# EasyEDA Pro project Controller_PCB.eprj

# Schematic Schematic1
Create Date: 2024-01-11; Page Name: P1; Project Name: 机甲杯手柄pcb; Schematic Name: Schematic1; Update Date: 2024-02-03; Company: 嘉立创EDA; Page Size: A4; Version: V1.0
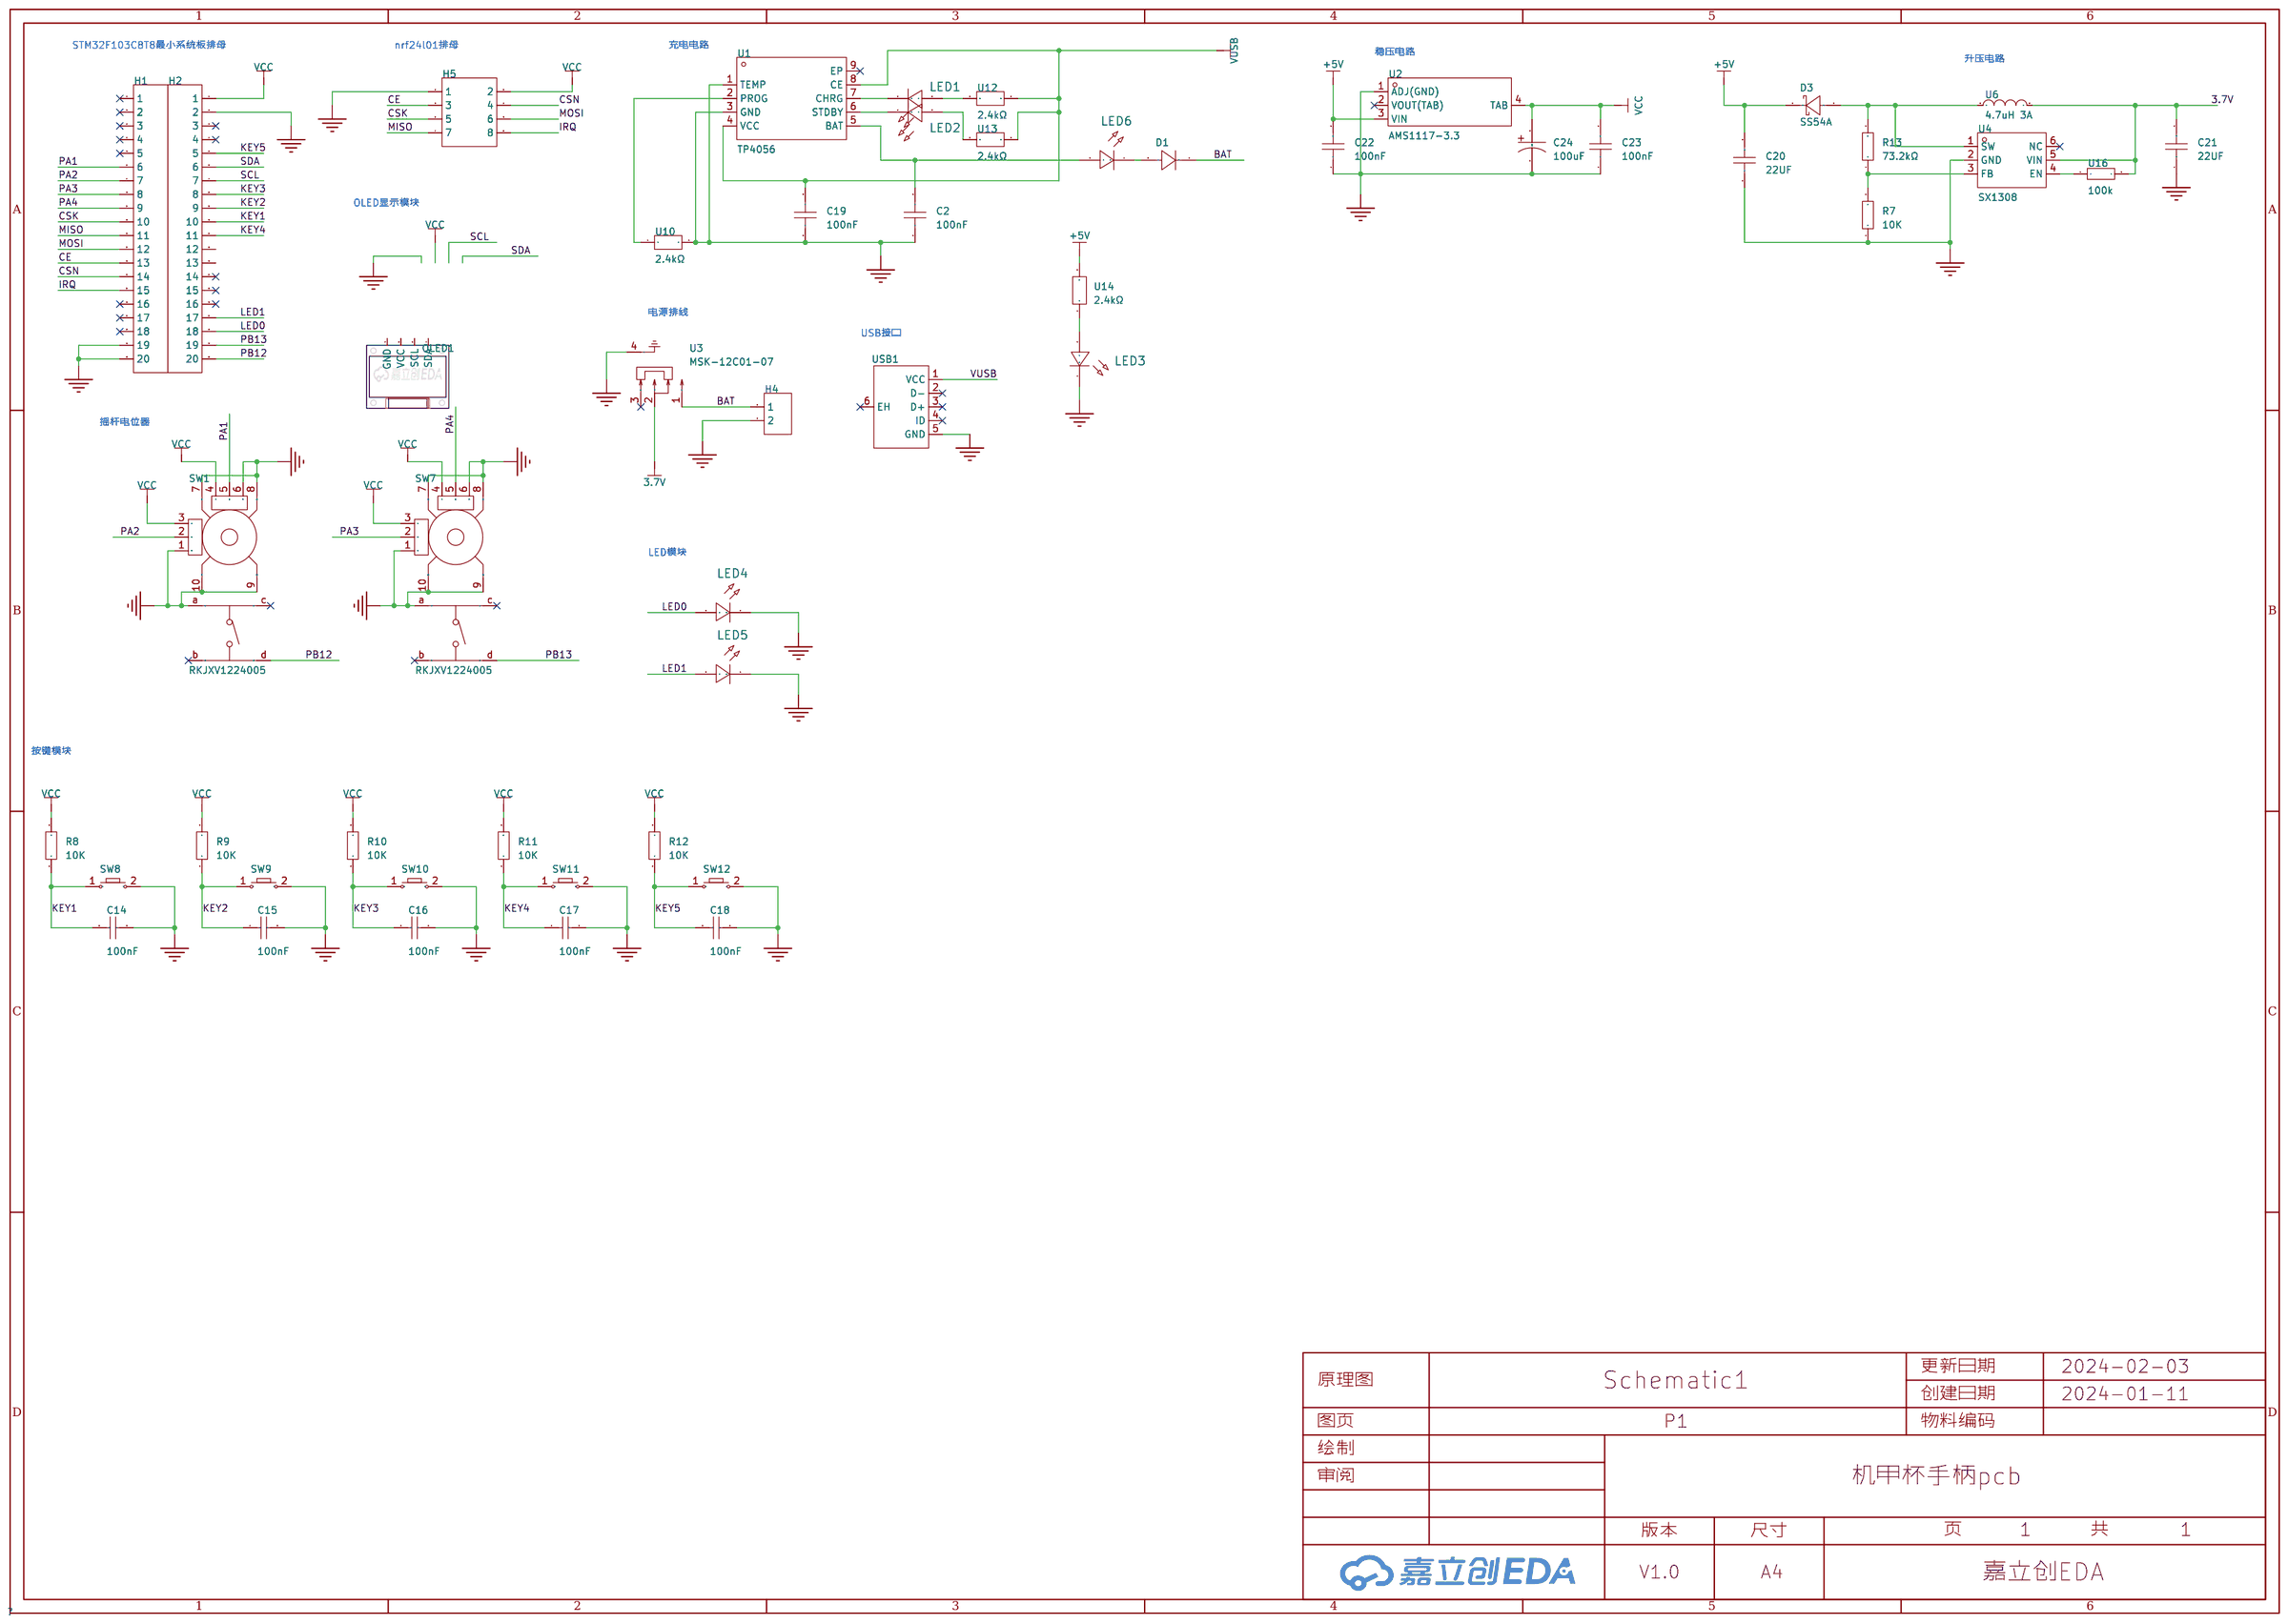
[diagram p0: schematic sheet]

## Parts
C2  100nF  [C0805]
C14  100nF  [C0805]
C15  100nF  [C0805]
C16  100nF  [C0805]
C17  100nF  [C0805]
C18  100nF  [C0805]
C19  100nF  [C0805]
C20  22UF  [C1206]
C21  22UF  [C1206]
C22  100nF  [C0603]
C23  100nF  [C0603]
C24  100uF  [CASE-D_7343]
D1  -  [DO_1N4007]
D3  SS54A  [SMA_L4.2-W2.6-LS5.1-RD]
H1  -  [HDR-TH_20P-P2.54-V-F]
H2  -  [HDR-TH_20P-P2.54-V-F]
H4  -  [HDR-TH_2P-P2.54-V-F]
H5  -  [HDR-TH_8P-P2.54-V-F-R2-C4-S2.54-1]
LED1  -  [LED_0603]
LED2  -  [LED_0603]
LED3  -  [LED_0603]
LED4  -  [LED_0603]
LED5  -  [LED_0603]
LED6  -  [LED_0603]
OLED1  -  [0.96OLED_4P]
R7  10K  [R0603]
R8  10K  [R0603]
R9  10K  [R0603]
R10  10K  [R0603]
R11  10K  [R0603]
R12  10K  [R0603]
R13  73.2kΩ  [R0603]
SW1  RKJXV1224005  [SW-TH_RKJXV1224005]
SW7  RKJXV1224005  [SW-TH_RKJXV1224005]
SW8  -  [Key_SMD_3x4x2]
SW9  -  [Key_SMD_3x4x2]
SW10  -  [Key_SMD_3x4x2]
SW11  -  [Key_SMD_3x4x2]
SW12  -  [Key_SMD_3x4x2]
U1  TP4056  [ESOP-8_L4.9-W3.9-P1.27-LS6.0-BL-EP]
U2  AMS1117-3.3  [SOT-223-4_L6.5-W3.5-P2.30-LS7.0-BR]
U3  MSK-12C01-07  [SW-SMD_MSK12CO2-BDM]
U4  SX1308  [SOT-23-6_L2.9-W1.6-P0.95-LS2.8-BL]
U6  4.7uH 3A  [IND-SMD_L7.3-W7.3_GSDRH74P]
U10  2.4kΩ  [R0603]
U12  2.4kΩ  [R0603]
U13  2.4kΩ  [R0603]
U14  2.4kΩ  [R0603]
U16  100k  [R0603]
USB1  -  [USB_Micro]

## Library data of the parts
C2 C14-C19 = CL21B104KCFNNNE: 容值:100nF;精度:±10%;额定电压:100V;材质(温度系数):X7R;; LCSC Part Name: 100nF ±10% 100V; Supplier Part: C28233; Manufacturer: SAMSUNG(三星); Supplier Footprint: 0805; JLCPCB Part Class: 基础库; Datasheet: https://atta.szlcsc.com/upload/public/pdf/source/20160218/1457707763339.pdf; Supplier: LCSC; Tolerance: ±10%; Voltage Rated: 100V; Temperature Coefficient: X7R
C20 C21 = 22UF: Supplier Part: C9900008064; Supplier Footprint: 1206; JLCPCB Part Class: 扩展库; Supplier: LCSC
C22 C23 = CC0603KRX7R9BB104: 容值:100nF;精度:±10%;额定电压:50V;材质(温度系数):X7R;; LCSC Part Name: 100nF ±10% 50V; Supplier Part: C14663; Manufacturer: YAGEO(国巨); Supplier Footprint: 0603; JLCPCB Part Class: 基础库; Datasheet: https://atta.szlcsc.com/upload/public/pdf/source/20180910/C282072_33301C7F631E79921B82A8DAC6BCC5B3.pdf; Supplier: LCSC; Tolerance: ±10%; Voltage Rated: 50V; Temperature Coefficient: X7R
C24 = NOJD107M006RWJ: 容值:100uF;精度:±20%;额定电压:6.3V;等效串联电阻:400mΩ@100kHz;; LCSC Part Name: 100uF ±20% 6.3V; Supplier Part: C308911; Manufacturer: Kyocera AVX; Supplier Footprint: CASE-D-7343; JLCPCB Part Class: 扩展库; Datasheet: https://atta.szlcsc.com/upload/public/pdf/source/20181129/C313062_608915A7FC61F417DBFBE9E11EC9EEDE.pdf; Supplier: LCSC; Tolerance: ±20%; Rated Voltage: 6.3V; Equivalent Series Resistance(ESR): 400mΩ@100kHz; Operating Temperature: -55℃~+105℃
D1 = D_1N4007A: Supplier Footprint: DO-41
D3 = SS54A: 二极管配置:独立式;正向压降(Vf):550mV@5A;直流反向耐压(Vr):40V;平均整流电流(Io):5A;; LCSC Part Name: 电压:40V 电流:5A; Supplier Part: C842792; Manufacturer: FUXINSEMI(富芯森美); Supplier Footprint: SMA(DO-214AC); JLCPCB Part Class: 扩展库; Datasheet: https://atta.szlcsc.com/upload/public/pdf/source/20200930/C842792_5106C80DF0E850BA03D1CC0EA757AD9D.pdf; Supplier: LCSC; Diode Configuration: 独立式; Forward Voltage (Vf@If): 550mV@5A; Reverse Voltage (Vr): 40V; Average Rectified Current (Io): 5A; Reverse Leakage Current (Ir): 500nA
H1 H2 = HDR-F_2.54_1x20P: Supplier Part: C50984; Supplier Footprint: 插件
H4 = HDR-F_2.54_1x2P: Supplier Part: C49661; Supplier Footprint: 插件
H5 = HDR-F_2.54_2x4: Supplier Part: C92271; Supplier Footprint: 插件; JLCPCB Part Class: 扩展库
LED1-LED6 = LED_0603-R: Supplier Footprint: 0603
OLED1 = 0.96OLED模块_4P: Supplier Footprint: 插件
R7-R12 = Res_0603: Supplier Footprint: 0603
R13 = AC0603FR-0773K2L: 电阻类型:厚膜电阻;阻值:73.2kΩ;精度:±1%;功率:100mW;最大工作电压:75V;温度系数:±100ppm/℃;; LCSC Part Name: 厚膜电阻 73.2kΩ ±1% 100mW; Supplier Part: C228044; Manufacturer: YAGEO(国巨); Supplier Footprint: 0603; JLCPCB Part Class: 扩展库; Datasheet: https://atta.szlcsc.com/upload/public/pdf/source/20181031/C228044_B46D30D08D205BDF2C7D9FF4D943A2A8.pdf; Supplier: LCSC; Type: 厚膜电阻; Tolerance: ±1%; Power(Watts): 100mW; Overload Voltage (Max): 75V; Temperature Coefficient: ±100ppm/℃; Operating Temperature Range: -55℃~+155℃
SW1 SW7 = RKJXV1224005: 操纵杆复位 中央按动开关 适用于航模玩具遥控器电位器、3D摇杆PS4手柄游戏机、无人机摇杆电位器、工业控制器; Supplier Part: C146170; Manufacturer: ALPSALPINE(阿尔卑斯阿尔派); Supplier Footprint: 插件,13x13mm; JLCPCB Part Class: 扩展库; Datasheet: https://atta.szlcsc.com/upload/public/pdf/source/20180125/C146170_15168615510911301620.pdf; Supplier: LCSC
SW8-SW12 = Key_SMD_3x4x2: Supplier Footprint: SMD
U1 = TP4056: Supplier Part: C9900002169; Supplier Footprint: ESOP-8; JLCPCB Part Class: 扩展库; Supplier: LCSC
U2 = AMS1117-3.3_C347222: 输出类型:固定;最大输入电压:18V;输出电压:3.3V;输出电流:1A;电源纹波抑制比(PSRR):60dB@(120Hz);输出极性:正;; LCSC Part Name: 输入18V 输出3.3V 1A; Supplier Part: C347222; Manufacturer: UMW(友台半导体); Supplier Footprint: SOT-223; JLCPCB Part Class: 扩展库; Datasheet: https://atta.szlcsc.com/upload/public/pdf/source/20231109/155D79A26D9DB04352555A58D5969DC8.pdf; Supplier: LCSC; Output Type: 固定; Maximum Input Voltage: 18V; Output Voltage: 3.3V; Output Current: 1A; Power Supply Rejection Ratio (PSRR): 60dB@(120Hz); Dropout Voltage: 1.3V@(1A); Output Polarity: 正; Number of Outputs: 1
U3 = MSK-12C01-07: Supplier Part: C9900005167; Supplier Footprint: SMD; JLCPCB Part Class: 扩展库; Supplier: LCSC
U4 = SX1308: 功能类型:升压型;同步整流:否;输出通道数:1;拓扑结构:升压式;输入电压:2V~24V;输出电压:28V;输出电流(最大值):-;开关频率:1.2MHz;; LCSC Part Name: 升压型 Vin=2V~24V Vout=28V; Supplier Part: C78162; Manufacturer: SX(硕芯科技); Supplier Footprint: SOT-23-6; JLCPCB Part Class: 扩展库; Datasheet: https://atta.szlcsc.com/upload/public/pdf/source/20160920/1474356679185.pdf; Supplier: LCSC; Function: 升压型; Synchronous Rectification: 否; Number of Outputs: 1; Topology: 升压式; Input Voltage: 2V~24V; Output Voltage: 28V; Switching Frequency: 1.2MHz
U6 = 4.7uH 3A: Supplier Part: C9900003590; Supplier Footprint: 4.7uH2A; JLCPCB Part Class: 扩展库; Datasheet: https://atta.szlcsc.comnull; Supplier: LCSC
U10 U12-U14 = PTFR0603B2K40N9: 电阻类型:薄膜电阻;阻值:2.4kΩ;精度:±0.1%;功率:100mW;最大工作电压:100V;温度系数:±10ppm/℃;; LCSC Part Name: 薄膜电阻 2.4kΩ ±0.1% 100mW; Supplier Part: C2692752; Manufacturer: RESI(开步睿思）; Supplier Footprint: 0603; JLCPCB Part Class: 扩展库; Datasheet: https://atta.szlcsc.com/upload/public/pdf/source/20231020/37F75D505DFC5CA75CC16B0F0ECD8764.pdf; Supplier: LCSC; Type: 薄膜电阻; Tolerance: ±0.1%; Power(Watts): 100mW; Overload Voltage (Max): 100V; Temperature Coefficient: ±10ppm/℃; Operating Temperature Range: -55℃~+125℃
U16 = 100k: Supplier Part: C9900012835; JLCPCB Part Class: 扩展库; Supplier: LCSC
USB1 = USB_Micro-B: Supplier Footprint: SMD

## Nets
3.7V: C21.2 U3.2 U4.5(VIN) U6.2 U16.2
+5V: C20.2 C22.2 D3.1(C) U2.3(VIN) U14.2
GND: C2.1 C14.2 C15.2 C16.2 C17.2 C18.2 C19.1 C20.1 C21.1 C22.1 C23.1 C24.2 H1.19 H1.20 H2.2 H4.2 H5.1 LED3.1(C) LED4.1(C) LED5.1(C) R7.1 SW1.1(B) SW1.6(B) SW1.7(GND) SW1.8(GND) SW1.9(GND) SW1.10(GND) SW1.a SW7.1(B) SW7.6(B) SW7.7(GND) SW7.8(GND) SW7.9(GND) SW7.10(GND) SW7.a SW8.2 SW9.2 SW10.2 SW11.2 SW12.2 U1.1(TEMP) U1.3(GND) U2.1(ADJ(GND)) U3.4 U4.2(GND) U10.2 USB1.5(GND)
VCC: C23.2 C24.1 H2.1 H5.2 R8.2 R9.2 R10.2 R11.2 R12.2 SW1.3(A) SW1.4(A) SW7.3(A) SW7.4(A) U2.4(TAB)
BAT: D1.1(K) H4.1 U3.1
CE: H1.13 H5.3
CSK: H1.10 H5.5
CSN: H1.14 H5.4
IRQ: H1.15 H5.8
KEY1: C14.1 H2.10 R8.1 SW8.1
KEY2: C15.1 H2.9 R9.1 SW9.1
KEY3: C16.1 H2.8 R10.1 SW10.1
KEY4: C17.1 H2.11 R11.1 SW11.1
KEY5: C18.1 H2.5 R12.1 SW12.1
LED0: H2.18 LED4.2(A)
LED1: H2.17 LED5.2(A)
MISO: H1.11 H5.7
MOSI: H1.12 H5.6
PA1: H1.6 SW1.5(DTA)
PA2: H1.7 SW1.2(DTA)
PA3: H1.8 SW7.2(DTA)
PA4: H1.9 SW7.5(DTA)
PB12: H2.20 SW1.d
PB13: H2.19 SW7.d
SCL: H2.7
SDA: H2.6
VUSB: C19.2 U1.4(VCC) U1.8(CE) U12.2 U13.2 USB1.1(VCC)
$1N9186: U1.2(PROG) U10.1
$1N9797: LED1.1(C) U1.7(CHRG)
$1N9800: LED2.1(C) U1.6(STDBY)
$1N9803: LED1.2(A) U12.1
$1N9806: LED2.2(A) U13.1
$1N10862: LED3.2(A) U14.1
$1N14342: U4.4(EN) U16.1
$1N14522: R7.2 R13.1 U4.3(FB)
$1N23594: C2.2 LED6.2(A) U1.5(BAT)
$1N23595: D1.2(A) LED6.1(C)
$1N23688: D3.2(A) R13.2 U4.1(SW) U6.1

Not connected (* = marked no-connect by the designer): H1 1* 2* 3* 4* 5* 16* 17* 18*; H2 3* 4* 12 13 14* 15* 16*; OLED1 1(GND) 2(VCC) 3(SCL) 4(SDA); SW1 b* c*; SW7 b* c*; U1 9(EP)*; U2 2(VOUT(TAB))*; U3 3*; U4 6(NC)*; USB1 2(D-)* 3(D+)* 4(ID)* 6(EH)*

## Notes on the sheet
- STM32F103C8T8最小系统板排母
- nrf24l01排母
- 充电电路
- 稳压电路
- 升压电路
- OLED显示模块
- 电源排线
- USB接口
- 摇杆电位器
- LED模块
- 按键模块

# Board PCB1
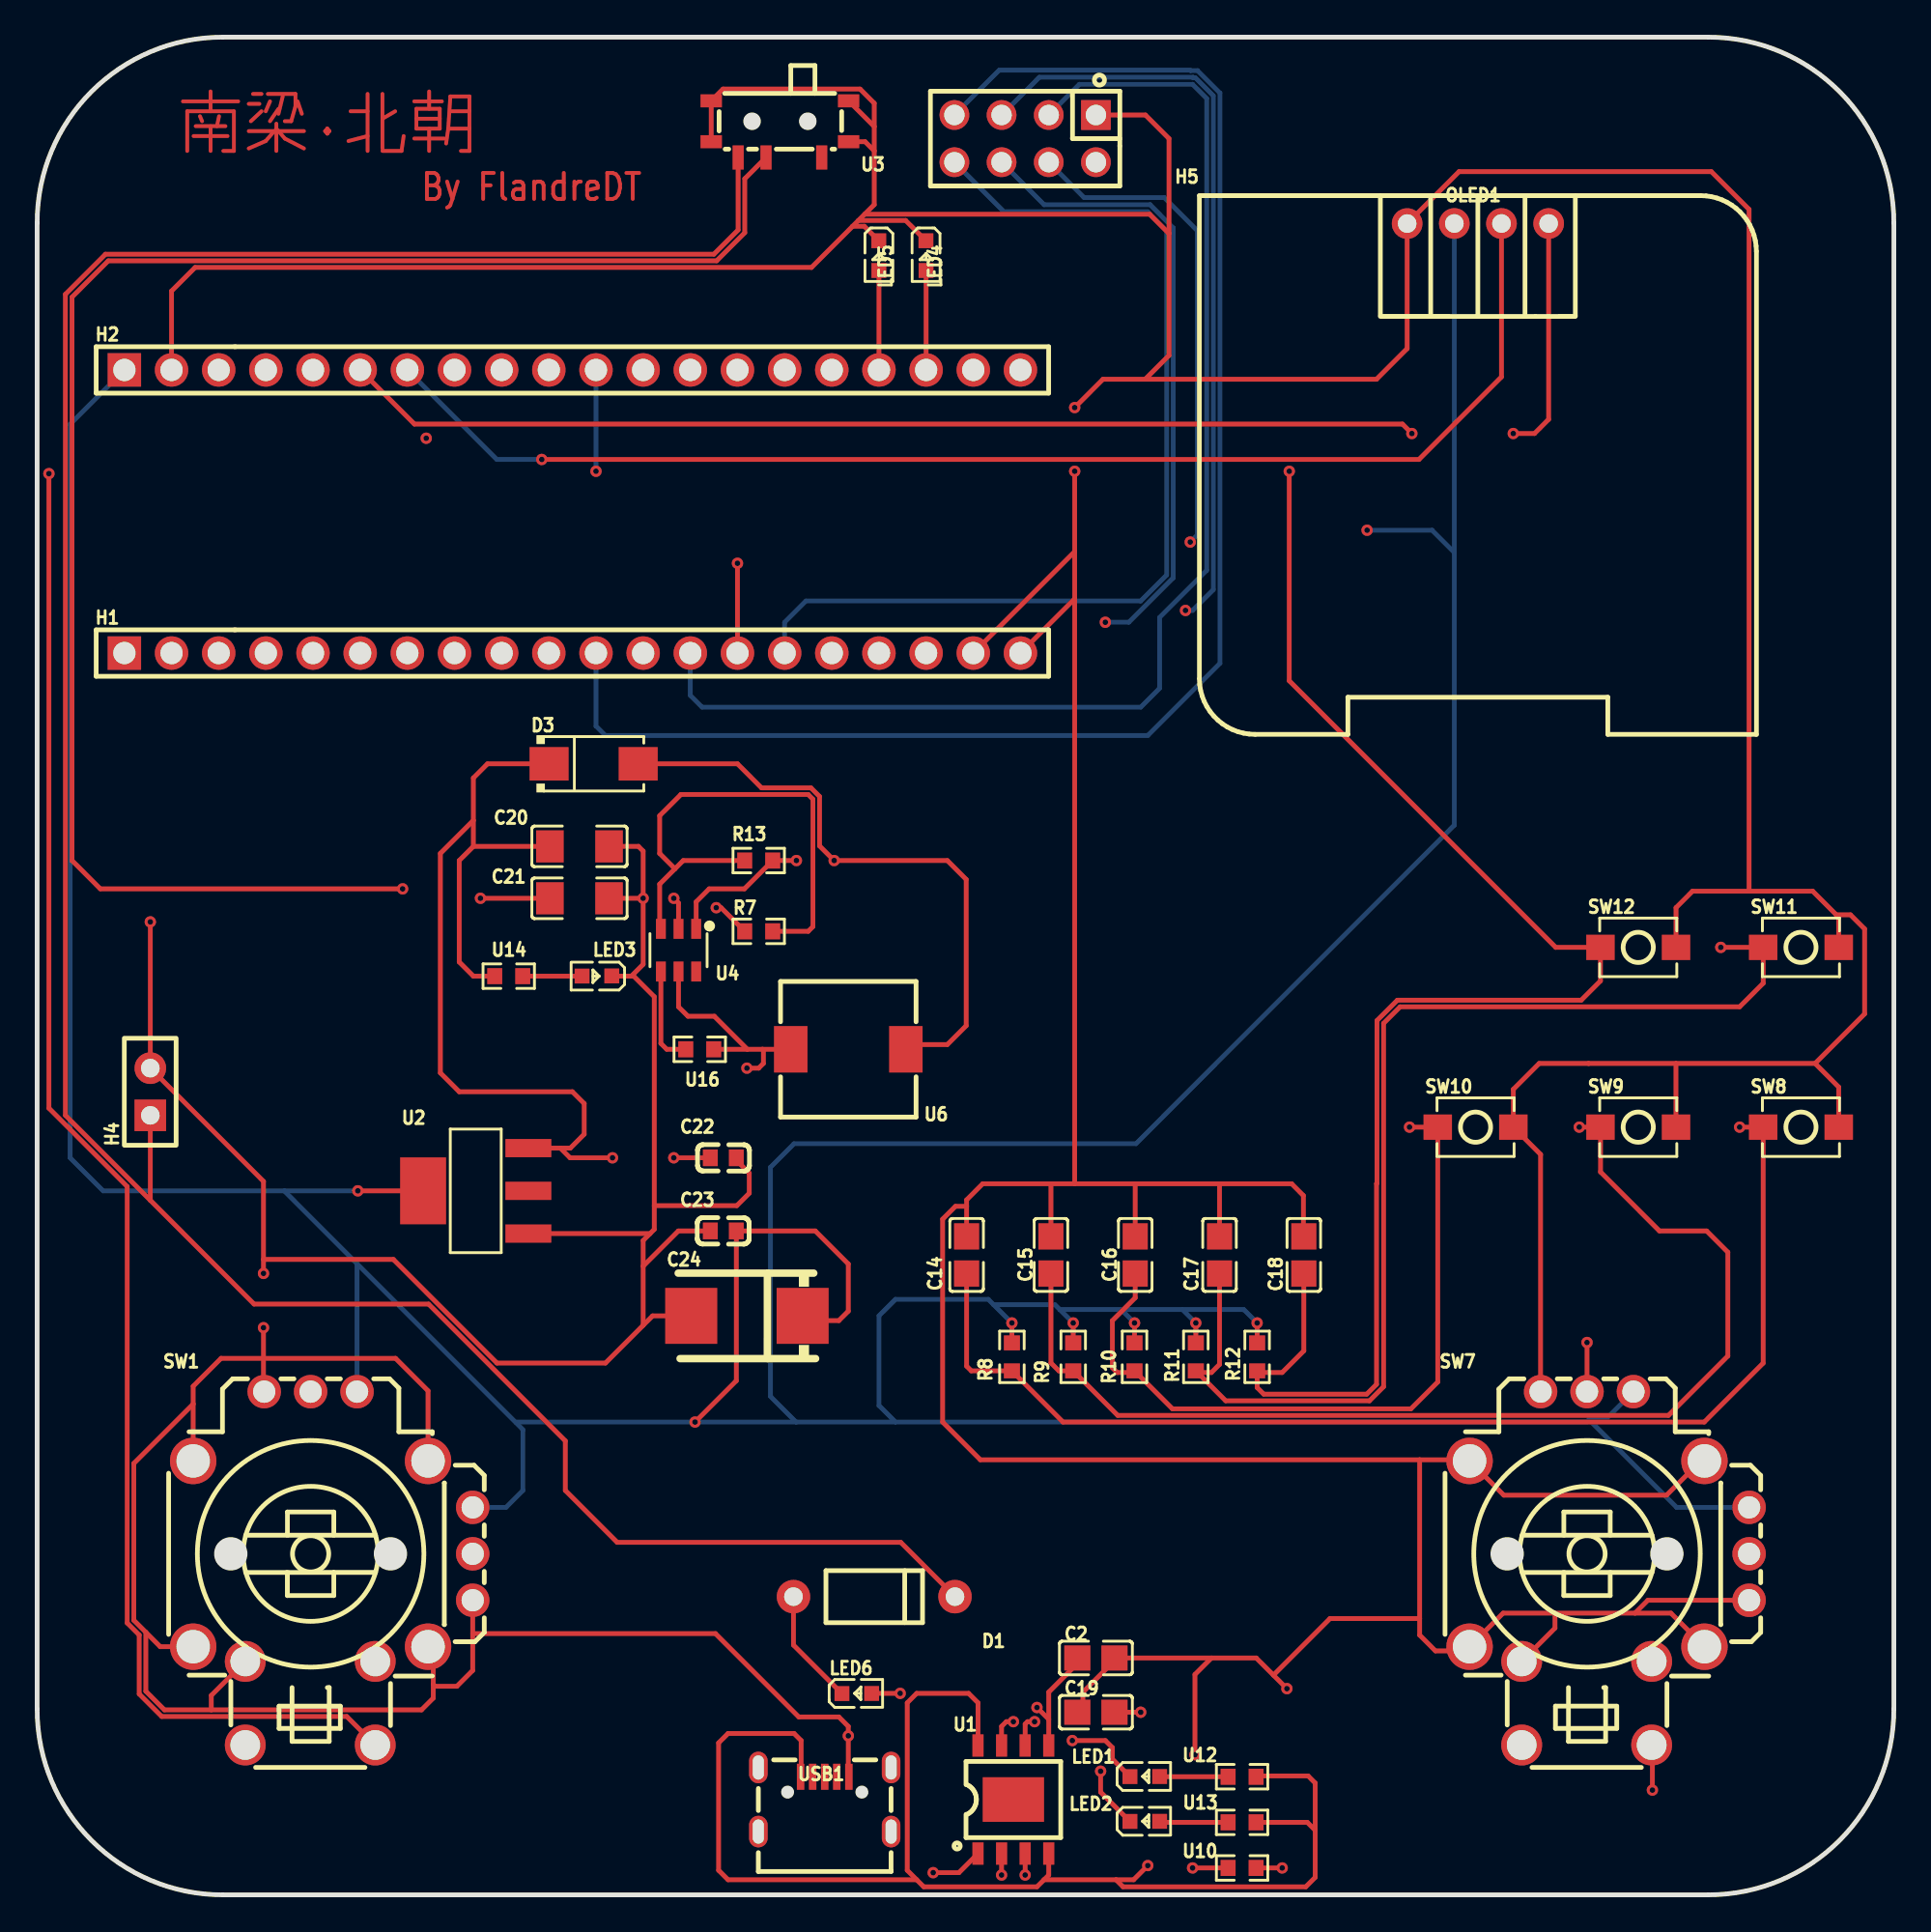
[diagram p1: board, top side]
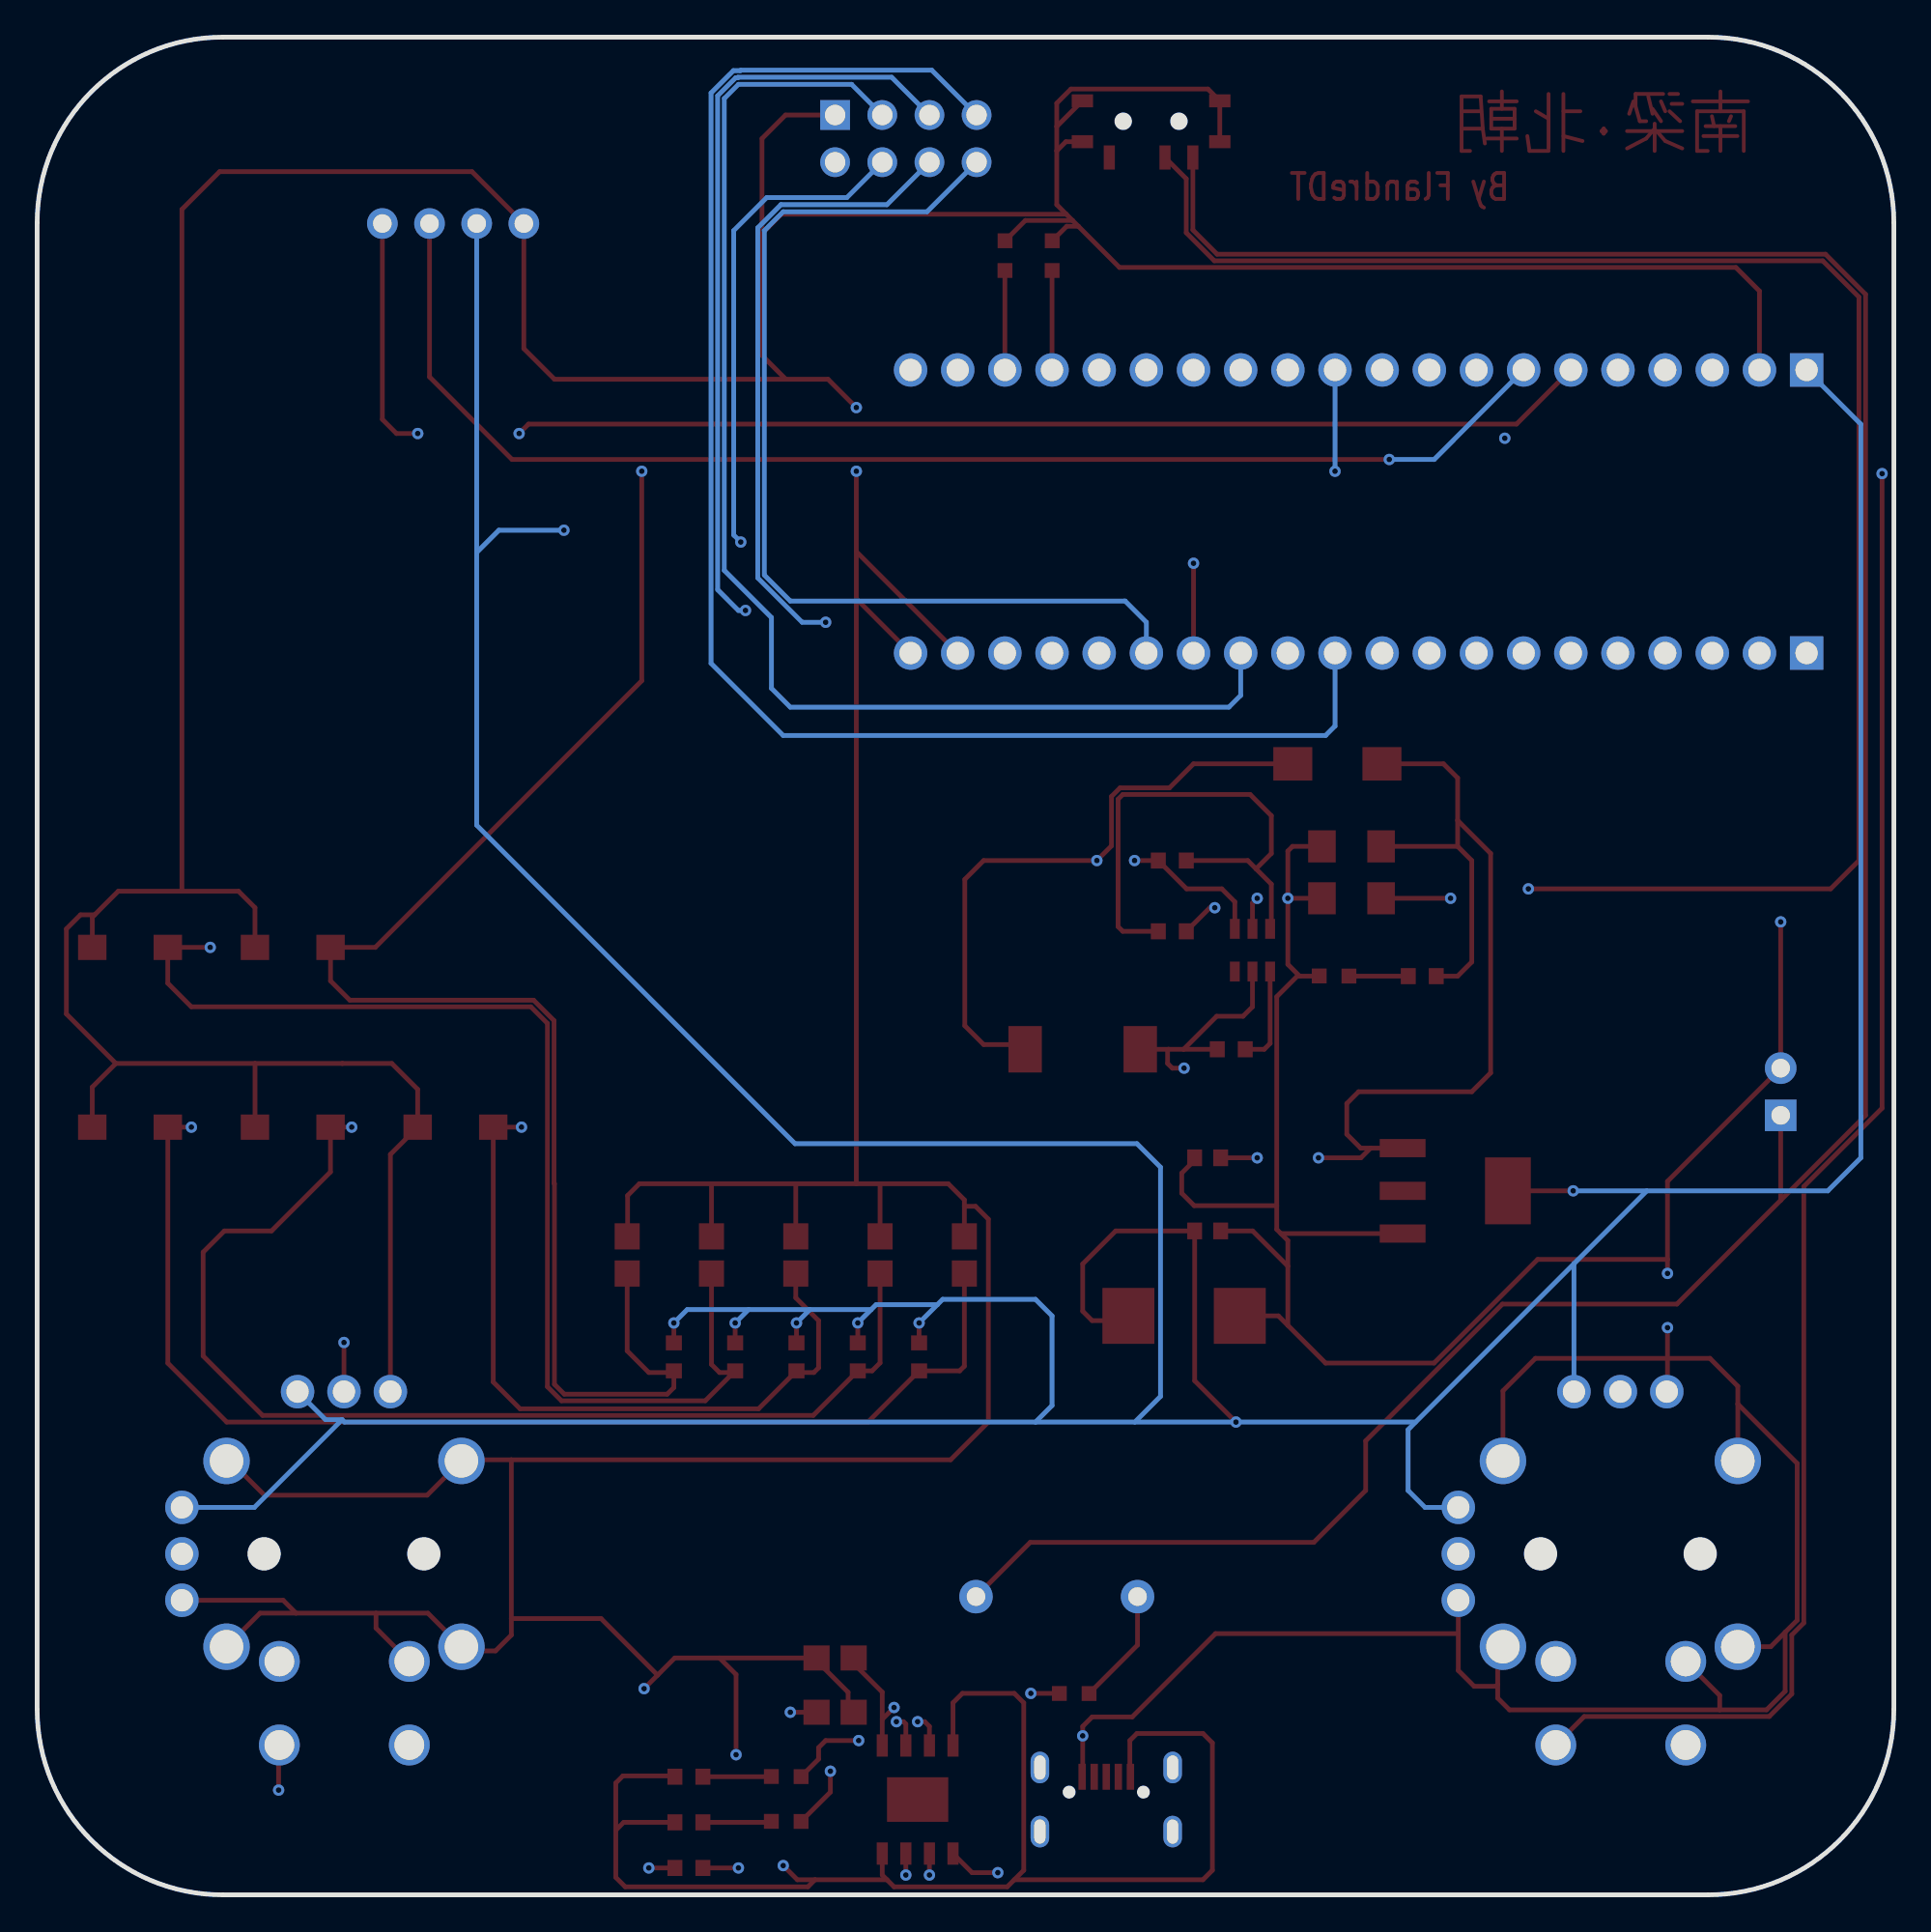
[diagram p2: board, bottom side, seen from below]

Outline 100 x 100 mm; copper layers: Top Layer, Inner1, 内层2, Bottom Layer. Coordinates in mm from the lower left corner of the outline.
Outline path: 0,90 arc(2.93,97.07) 10,100 90,100 arc(97.07,97.07) 100,90 100,10 arc(97.07,2.93) 90,0 10,0 arc(2.93,2.93) 0,10 0,90
Stack: Top Layer 0.035mm 外层铜厚1oz / Dielectric1 0.2104mm 7628 RC49% 8.6mil / Inner1 0.0152mm 内层铜厚 / Dielectric2 1.065mm 1.1mm H/HOZ 含铜 / 内层2 0.0152mm 内层铜厚 / Dielectric3 0.2104mm 7628 RC49% 8.6mil / Bottom Layer 0.035mm 外层铜厚1oz

## Design rules (mm)
template: 自定义配置
spacing copperThickness1oz (default): track to track 0.102, other pairs 0.152 to 0.3
spacing copperThickness2oz: track to track 0.203, other pairs 0.152 to 0.3
track width copperThickness1oz (default): min 0.127, default 0.254, max 2.54
track width copperThickness2oz: min 0.203, default 0.254, max 2.54
differential pair differentialPair (default): width min 0.127, default 0.254, max 2.54; gap min 0.152, default 0.152
via viaSize (default): diameter min 0.5, default 0.61, max 10; hole min 0.3, default 0.305, max 6.3

## Placement (name value [footprint] x y rotation side)
C2  100nF  [C0805]  57.02 12.75 180 top
C14  100nF  [C0805]  50.06 34.45 90 top
C15  100nF  [C0805]  54.6 34.45 90 top
C16  100nF  [C0805]  59.14 34.45 90 top
C17  100nF  [C0805]  63.68 34.45 90 top
C18  100nF  [C0805]  68.22 34.45 90 top
C19  100nF  [C0805]  57.02 9.83 0 top
C20  22UF  [C1206]  29.21 56.44 180 top
C21  22UF  [C1206]  29.21 53.65 180 top
C22  100nF  [C0603]  36.96 39.68 180 top
C23  100nF  [C0603]  36.96 35.74 0 top
C24  100uF  [CASE-D_7343]  38.23 31.17 0 top
D1  -  [DO_1N4007]  45.08 16.05 180 top
D3  SS54A  [SMA_L4.2-W2.6-LS5.1-RD]  29.97 60.88 0 top
H1  -  [HDR-TH_20P-P2.54-V-F]  28.83 66.85 0 top
H2  -  [HDR-TH_20P-P2.54-V-F]  28.83 82.09 0 top
H4  -  [HDR-TH_2P-P2.54-V-F]  6.1 43.23 90 top
H5  -  [HDR-TH_8P-P2.54-V-F-R2-C4-S2.54-1]  53.21 94.54 180 top
LED1  -  [LED_0603]  59.71 6.38 0 top
LED2  -  [LED_0603]  59.71 3.96 0 top
LED3  -  [LED_0603]  30.1 49.45 180 top
LED4  -  [LED_0603]  47.88 88.19 270 top
LED5  -  [LED_0603]  45.34 88.19 270 top
LED6  -  [LED_0603]  44.2 10.85 0 top
OLED1  -  [0.96OLED_4P]  77.6 89.97 0 top
R7  10K  [R0603]  38.86 51.87 0 top
R8  10K  [R0603]  52.5 28.96 90 top
R9  10K  [R0603]  55.8 28.96 90 top
R10  10K  [R0603]  59.1 28.96 90 top
R11  10K  [R0603]  62.4 28.96 90 top
R12  10K  [R0603]  65.71 28.96 90 top
R13  73.2kΩ  [R0603]  38.86 55.68 0 top
SW1  RKJXV1224005  [SW-TH_RKJXV1224005]  15.93 17.58 0 top
SW7  RKJXV1224005  [SW-TH_RKJXV1224005]  84.68 17.58 0 top
SW8  -  [Key_SMD_3x4x2]  95 41.33 0 top
SW9  -  [Key_SMD_3x4x2]  86.23 41.33 0 top
SW10  -  [Key_SMD_3x4x2]  77.47 41.33 0 top
SW11  -  [Key_SMD_3x4x2]  95 51 0 top
SW12  -  [Key_SMD_3x4x2]  86.23 51 0 top
U1  TP4056  [ESOP-8_L4.9-W3.9-P1.27-LS6.0-BL-EP]  52.58 5.13 0 top
U2  AMS1117-3.3  [SOT-223-4_L6.5-W3.5-P2.30-LS7.0-BR]  23.62 37.9 0 top
U3  MSK-12C01-07  [SW-SMD_MSK12CO2-BDM]  40 95.05 180 top
U4  SX1308  [SOT-23-6_L2.9-W1.6-P0.95-LS2.8-BL]  34.54 50.85 180 top
U6  4.7uH 3A  [IND-SMD_L7.3-W7.3_GSDRH74P]  43.69 45.52 180 top
U10  2.4kΩ  [R0603]  64.9 1.45 0 top
U12  2.4kΩ  [R0603]  64.9 6.36 0 top
U13  2.4kΩ  [R0603]  64.9 3.9 0 top
U14  2.4kΩ  [R0603]  25.4 49.45 180 top
U16  100k  [R0603]  35.69 45.52 0 top
USB1  -  [USB_Micro]  42.42 5.13 0 top

## Footprints (pads in the part's own frame, mm; a bottom-side part is the same pattern mirrored in y, then rotated)
0.96OLED_4P
  round 1.65 hole 1: 1(-3.81,-0.002) 2(-1.27,0.002) 3(1.27,0.002) 4(3.81,0.002)
C0603
  rect 0.8x0.9 smd: 1(-0.7,0) 2(0.7,0)
C0805
  rect 1.41x1.35 smd: 1(-1,0) 2(1,0)
C1206
  rect 1.485x1.728 smd: 1(-1.593,0) 2(1.593,0)
CASE-D_7343
  rect 2.799x3.01 smd: 1(3,0) 2(-3,0)
DO_1N4007
  round 1.8 hole 1: 1(-4.35,0) 2(4.35,0)
ESOP-8_L4.9-W3.9-P1.27-LS6.0-BL-EP
  rect 0.6x1.2 smd: 1(-1.905,-2.909) 2(-0.635,-2.909) 3(0.635,-2.909) 4(1.905,-2.909) 5(1.905,2.909) 6(0.635,2.909) 7(-0.635,2.909) 8(-1.905,2.909)
  rect 3.3x2.4 smd: 9(0,0)
HDR-TH_2P-P2.54-V-F
  rect 1.7x1.7 hole 1: 1(-1.27,0)
  round 1.7 hole 1: 2(1.27,0)
HDR-TH_8P-P2.54-V-F-R2-C4-S2.54-1
  rect 1.6x1.6 hole 1.1: 1(-3.81,-1.27)
  round 1.6 hole 1.1: 2(-3.81,1.27) 3(-1.27,-1.27) 4(-1.27,1.27) 5(1.27,-1.27) 6(1.27,1.27) 7(3.81,-1.27) 8(3.81,1.27)
HDR-TH_20P-P2.54-V-F
  rect 1.8x1.8 hole 1.2: 1(-24.13,0)
  round 1.8 hole 1.2: 2(-21.59,0) 3(-19.05,0) 4(-16.51,0) 5(-13.97,0) 6(-11.43,0) 7(-8.89,0) 8(-6.35,0) 9(-3.81,0) 10(-1.27,0) 11(1.27,0) 12(3.81,0) 13(6.35,0) 14(8.89,0) 15(11.43,0) 16(13.97,0) 17(16.51,0) 18(19.05,0) 19(21.59,0) 20(24.13,0)
IND-SMD_L7.3-W7.3_GSDRH74P
  rect 1.8x2.5 smd: 1(-3.1,0) 2(3.1,0)
Key_SMD_3x4x2
  rect 1.53x1.36 smd: 1(-2.035,0) 2(2.035,0)
LED_0603
  rect 0.8x0.8 smd: 1(-0.851,-0.01) 2(0.75,-0.005)
R0603
  rect 0.806x0.864 smd: 1(-0.753,0) 2(0.753,0)
SMA_L4.2-W2.6-LS5.1-RD
  rect 2.1x1.8 smd: 1(-2.4,0) 2(2.4,0)
SOT-23-6_L2.9-W1.6-P0.95-LS2.8-BL
  rect 0.532x1.072 smd: 1(-0.95,-1.149) 2(0,-1.149) 3(0.95,-1.149) 4(0.95,1.149) 5(0,1.149) 6(-0.95,1.149)
SOT-223-4_L6.5-W3.5-P2.30-LS7.0-BR
  rect 2.47x0.98 smd: 1(2.835,-2.3) 2(2.835,0) 3(2.835,2.3)
  rect 2.47x3.6 smd: 4(-2.835,0)
SW-SMD_MSK12CO2-BDM
  rect 0.6x1.3 smd: 1(2.25,1.525) 2(0.75,1.525) 3(-2.25,1.525)
  rect 1.15x0.7 smd: 4(-3.7,0.675) 4(-3.7,-1.525) 4(3.7,0.675) 4(3.7,-1.525)
SW-TH_RKJXV1224005
  round 1.8 hole 1.2: 1(7.527,-1.719) 2(7.527,0.781) 3(7.527,3.281) 4(1.298,9.511) 5(-1.202,9.511) 6(-3.703,9.511)
  round 2.5 hole 1.8: 7(-7.527,5.781) 8(-7.527,-4.219) 9(5.122,-4.219) 10(5.122,5.781)
  round 2.2 hole 1.6: a(-4.721,-5.011) b(-4.721,-9.511) c(2.279,-5.011) d(2.279,-9.511)
USB_Micro
  rect 0.4x1.4 smd: 1(-1.3,1.225) 2(-0.65,1.225) 3(0,1.225) 4(0.65,1.225) 5(1.3,1.225)
  oval 1x1.7 hole 0.6x1.3: 6(-3.575,1.725) 6(-3.575,-1.725) 6(3.575,1.725) 6(3.575,-1.725)

## Nets
As in the schematic, except:
GND: C2.1 C14.2 C15.2 C16.2 C17.2 C18.2 C19.1 C20.1 C21.1 C22.1 C23.1 C24.2 H1.19 H1.20 H2.2 H4.2 H5.1 LED3.1 LED4.1 LED5.1 OLED1.1 R7.1 SW1.1 SW1.6 SW1.7 SW1.8 SW1.9 SW1.10 SW1.a SW7.1 SW7.6 SW7.7 SW7.8 SW7.9 SW7.10 SW7.a SW8.2 SW9.2 SW10.2 SW11.2 SW12.2 U1.1 U1.3 U2.1 U3.4 U4.2 U10.2 USB1.5
VCC: C23.2 C24.1 H2.1 H5.2 OLED1.2 R8.2 R9.2 R10.2 R11.2 R12.2 SW1.3 SW1.4 SW7.3 SW7.4 U2.4
SCL: H2.7 OLED1.3
SDA: H2.6 OLED1.4

Pads without a net: H1 1 2 3 4 5 16 17 18; H2 3 4 12 13 14 15 16; SW1 b c; SW7 b c; U1 9; U2 2; U3 3; U4 6; USB1 2 3 4 6

## Via types
v1: diameter 0.61, hole 0.305, Top Layer to Bottom Layer, 56 vias

## Routing (per net, layer and track width the routed paths; a pad name or vN(x,y) marks a point on that pad's centre or on a via; arc(x,y) is an arc through that point)
3.7V: length 139
  Top Layer w0.254: C21.2 v1(23.88,53.65) ; v1(19.68,54.15) 3.4,54.15 1.88,55.68 1.88,86.01 3.83,87.96 36.6,87.96 38.11,89.47 38.11,92.38 U3.2 ; 38.25,45.52 36.47,47.3 35.05,47.3 34.54,47.8 U4.5 ; 38.25,45.52 39.07,45.52 ; 38.25,45.52 U16.2 ; 39.07,45.52 39.12,45.47 39.12,44.76 38.86,44.5 v1(38.23,44.5) ; 39.07,45.52 U6.2
  Inner1 w0.254: v1(19.68,54.15) 23.37,54.15 v1(23.88,53.65) 22.22,53.65 21.46,52.88 21.46,45.26 22.22,44.5 v1(38.23,44.5)
+5V: length 57.1
  Top Layer w0.254: v1(34.29,39.68) 36.38,39.68 ; U14.2 23.49,49.45 22.73,50.22 22.73,55.68 23.49,56.44 ; 23.49,56.44 C20.2 ; 23.49,56.44 23.49,57.84 ; v1(30.99,39.68) 28.7,39.68 28.18,40.2 ; 28.18,40.2 28.72,40.2 29.46,40.95 29.46,42.6 28.83,43.23 22.73,43.23 21.72,44.25 21.72,56.06 23.49,57.84 ; 28.18,40.2 U2.3 ; 23.49,57.84 23.49,60.12 24.26,60.88 D3.1
  Inner1 w0.254: v1(30.99,39.68) v1(34.29,39.68)
GND: length 744.7
  Top Layer w0.254: C18.2 68.2,35.47 68.2,37.64 67.56,38.28 63.68,38.28 ; 88.27,41.33 88.27,44.76 ; 88.27,44.76 95.76,44.76 ; 88.27,44.76 83.56,44.76 ; 12.19,28.88 12.19,27.13 SW1.6 ; 12.19,28.88 v1(12.19,30.53) ; 12.19,28.88 9.91,28.88 8.4,27.38 8.4,26.42 ; 12.19,28.88 19.3,28.88 21.05,27.13 SW1.10 ; C20.1 32.39,56.44 32.64,56.19 v1(32.64,53.65) ; 63.68,38.28 63.68,38.28 C17.2 ; 63.68,38.28 59.14,38.28 ; v1(62.36,7.54) 62.36,11.86 63.25,12.75 ; 32.64,30.66 33.15,31.17 C24.2 ; 32.64,30.66 30.61,28.63 24.77,28.63 19.18,34.21 12.19,34.21 ; 32.64,30.66 32.64,33.84 ; 45.08,93.88 45.08,90.98 44.57,90.47 ; 45.08,93.88 45.08,95.19 ; 45.08,93.88 44.59,94.37 U3.4 ; SW7.6 80.97,39.86 SW10.2 79.5,43.36 80.9,44.76 83.56,44.76 ; USB1.5 43.69,6.39 v1(43.69,8.56) 43.69,9.07 43.18,9.58 41.02,9.58 36.53,14.06 23.46,14.06 ; H2.2 7.24,86.33 8.51,87.6 41.71,87.6 43.92,89.82 ; 95.76,44.76 98.42,47.42 98.42,51.99 97.66,52.76 96.9,52.76 ; 95.76,44.76 97.03,43.48 SW8.2 ; 44.23,90.13 43.92,89.82 ; 44.23,90.13 44.57,90.47 ; 44.23,90.13 46.78,90.13 47.87,89.04 ; 43.92,89.82 44.55,89.82 LED5.1 ; C23.1 34.53,35.74 32.64,33.84 ; LED3.1 30.96,49.45 32,49.45 ; 96.9,52.76 95.63,54.03 92.16,54.03 ; 96.9,52.76 97.03,52.63 97.03,50.64 ; 81.75,15.16 78.96,15.16 76.92,13.13 75.31,13.13 74.46,13.98 74.46,14.87 ; 81.75,15.16 86.06,15.16 ; 81.75,15.16 81.75,14.36 SW7.a ; U2.1 33.01,35.6 ; 33.01,35.6 32.64,35.22 32.64,33.84 ; 33.01,35.6 33.24,35.82 33.24,37.1 ; 59.68,81.59 72.14,81.59 73.79,83.24 OLED1.1 76.58,92.76 90.17,92.76 92.2,90.73 92.2,54.07 92.16,54.03 ; 59.68,81.59 57.4,81.59 v1(55.88,80.06) ; 59.68,81.59 60.96,82.87 60.96,89.43 ; 45.08,95.19 U3.4 ; 45.08,95.19 45.08,96.44 44.32,97.21 36.94,97.21 U3.4 U3.4 ; C15.2 54.6,38.27 54.61,38.28 ; 23.46,14.06 23.46,12.08 22.61,11.23 21.44,11.23 21.34,11.33 ; 23.46,14.06 SW1.1 ; v1(48.26,1.19) 49.64,1.19 U1.1 ; 55.88,69.77 55.88,72.31 ; 55.88,69.77 55.88,38.28 ; 55.88,69.77 H1.20 ; 55.88,72.31 H1.19 ; 55.88,72.31 v1(55.88,76.63) ; 60.96,89.43 59.92,90.47 44.57,90.47 ; 60.96,89.43 60.96,94.54 59.69,95.81 H5.1 ; 59.14,38.28 59.14,38.27 C16.2 ; 59.14,38.28 55.88,38.28 ; 8.4,26.42 5.21,23.22 5.21,14.78 5.85,14.14 ; 8.4,26.42 SW1.7 ; 63.25,12.75 65.66,12.75 66.58,11.83 ; 63.25,12.75 58.17,12.75 56.32,10.91 56.32,9.83 ; v1(34.29,53.65) 34.54,53.39 U4.2 ; SW7.10 89.6,23.36 87.76,21.51 78.99,21.51 77.09,23.42 74.46,23.42 ; 66.58,11.83 69.63,14.87 74.46,14.87 ; 66.58,11.83 v1(67.31,11.1) ; SW1.8 6.63,13.36 5.85,14.14 ; 32,49.45 32.64,50.09 v1(32.64,53.65) ; 32,49.45 32.13,49.45 33.24,48.35 33.24,37.1 ; 12.19,34.21 v1(12.19,33.45) ; 12.19,34.21 12.19,38.41 H4.2 v1(6.1,52.38) ; SW7.9 87.99,15.16 86.06,15.16 ; v1(36.58,53.14) 36.84,53.14 R7.1 ; 86.06,15.16 86.75,15.86 SW7.1 ; 92.16,54.03 89.15,54.03 88.27,53.14 SW12.2 ; 54.61,38.28 55.88,38.28 ; 54.61,38.28 50.93,38.28 50.06,37.41 50.06,37.06 ; 33.24,37.1 37.68,37.1 38.35,37.77 38.35,38.85 37.66,39.55 ; 74.46,14.87 74.46,23.42 ; 5.85,14.14 5.85,10.96 6.86,9.96 9.38,9.96 ; 83.56,44.75 83.56,44.76 ; v1(32.64,53.65) C21.1 ; U10.2 v1(67.06,1.45) ; 50.06,37.06 C14.2 ; 50.06,37.06 49.46,37.06 48.77,36.37 48.77,25.45 50.8,23.42 74.46,23.42 ; 9.38,9.96 20.7,9.96 21.34,10.59 21.34,11.33 ; 9.38,9.96 9.38,10.74 SW1.a ; v1(53.21,1.07) U1.3 ; 21.34,11.33 21.34,13.08 SW1.9
  Inner1 w0.254: v1(34.29,53.65) v1(32.64,53.65) ; v1(67.31,11.1) 69.72,8.69 69.72,1.96 69.21,1.45 v1(67.06,1.45) ; v1(43.69,8.56) 45.97,8.56 48.26,6.27 v1(48.26,1.19) ; v1(12.19,33.45) v1(12.19,30.53) ; v1(53.21,1.07) 53.49,0.79 60.25,0.79 62.36,2.9 v1(62.36,7.54) ; v1(55.88,76.63) v1(55.88,80.06)
  内层2 w0.254: v1(36.58,53.14) 36.07,53.65 v1(34.29,53.65) ; v1(6.1,52.38) 6.1,57.07 1.14,62.03 1.14,75.99 H2.2
VCC: length 353.9
  Top Layer w0.254: R11.2 v1(62.4,30.78) ; R12.2 v1(65.71,30.78) ; v1(35.43,25.45) 37.66,27.68 C23.2 41.91,35.74 43.69,33.96 43.69,31.42 43.18,30.91 41.48,30.91 C24.1 ; R10.2 v1(59.1,30.78) ; v1(17.27,37.9) U2.4 ; R8.2 v1(52.5,30.78) ; R9.2 v1(55.8,30.78)
  Inner1 w0.254: H5.2 65.53,93.27 70.23,88.57 70.23,74.85 v1(71.63,73.46)
  Bottom Layer w0.254: 17.23,33.97 SW1.4 ; 17.23,33.97 13.31,37.9 ; 17.23,33.97 26.16,25.04 26.16,21.77 25.25,20.86 SW1.3 ; OLED1.2 76.33,72.26 ; 76.33,72.26 76.33,57.58 59.18,40.44 40.77,40.44 39.5,39.17 39.5,26.83 40.88,25.45 ; 76.33,72.26 75.13,73.46 v1(71.63,73.46) ; v1(59.1,30.78) 58.38,31.5 ; 58.38,31.5 61.68,31.5 ; 58.38,31.5 55.08,31.5 ; SW7.3 88.3,20.86 83.58,25.58 ; 25.78,25.45 v1(35.43,25.45) 40.88,25.45 ; 13.31,37.9 3.56,37.9 1.78,39.68 1.78,79.17 H2.1 ; 13.31,37.9 v1(17.27,37.9) ; 51.52,31.77 51.23,32.06 46.23,32.06 45.34,31.17 45.34,26.34 46.23,25.45 ; 51.52,31.77 54.82,31.77 55.08,31.5 ; 51.52,31.77 v1(52.5,30.78) ; 61.68,31.5 v1(62.4,30.78) ; 61.68,31.5 64.99,31.5 v1(65.71,30.78) ; 40.88,25.45 46.23,25.45 ; SW7.4 84.46,25.58 83.58,25.58 ; v1(55.8,30.78) 55.08,31.5 ; 46.23,25.45 83.45,25.45 83.58,25.58
BAT: length 150.7
  Top Layer w0.254: D1.1 46.51,18.97 31.24,18.97 28.45,21.77 28.45,24.44 21.08,31.8 11.68,31.8 6.1,37.39 ; 6.1,37.39 1.52,41.96 1.52,86.16 3.68,88.32 36.45,88.32 37.75,89.62 U3.1 ; 6.1,37.39 H4.1 6.22,42.09
CE: length 70.5
  Bottom Layer w0.254: H5.3 56.13,97.46 62.23,97.46 62.99,96.7 62.99,71.3 60.45,68.76 60.45,64.95 59.44,63.93 35.81,63.93 35.18,64.57 H1.13
CSK: length 76.5
  内层2 w0.254: v1(61.85,69.14) 29.85,69.14 H1.10
  Bottom Layer w0.254: v1(61.85,69.14) 62.23,69.14 63.35,70.26 63.35,96.85 62.38,97.82 62.25,97.81 62.25,97.84 53.97,97.84 51.94,95.81
CSN: length 56.1
  Top Layer w0.254: v1(37.72,71.68) H1.14
  内层2 w0.254: v1(37.72,71.68) 38.86,72.82 v1(62.1,72.82)
  Bottom Layer w0.254: v1(62.1,72.82) 62.48,73.2 62.48,89.59 60.71,91.36 56.39,91.36 H5.4
IRQ: length 54.8
  Bottom Layer w0.254: H1.15 40.26,68.5 41.4,69.65 59.44,69.65 60.83,71.04 60.83,89.59 59.82,90.6 52.07,90.6 49.4,93.27
KEY1: length 160.1
  Top Layer w0.254: C14.1 50.06,28.46 50.31,28.21 R8.1 55.25,25.45 89.79,25.45 92.96,28.62 SW8.1 v1(91.69,41.33)
  Inner1 w0.254: H2.10 27.56,80.19 28.7,79.05 51.94,79.05 53.54,80.65 56.44,80.65 57.28,79.81 57.28,74.97 60.66,71.59 60.66,55.6 73.17,43.08 89.94,43.08 v1(91.69,41.33)
KEY2: length 148.6
  Top Layer w0.254: C15.1 54.6,28.64 55.03,28.21 R9.1 58.2,25.81 87.86,25.81 91.06,29.01 91.06,34.6 89.92,35.74 87.38,35.74 84.2,38.91 84.2,41.33 ; v1(83.06,41.33) SW9.1
  Inner1 w0.254: H2.9 25.02,77.39 26.57,75.85 55.9,75.85 60.3,71.45 60.3,55.44 73.02,42.72 81.03,42.72 82.42,41.33 v1(83.06,41.33)
KEY3: length 120.7
  Top Layer w0.254: v1(73.91,41.33) SW10.1 75.43,27.61 73.99,26.16 61.15,26.16 R10.1 59.02,28.12 58.17,28.12 57.91,28.37 57.91,30.91 59.14,32.14 C16.1
  Inner1 w0.254: H2.8 22.48,76.89 23.88,75.49 55.75,75.49 59.94,71.3 59.94,55.3 v1(73.91,41.33)
KEY4: length 139.1
  Top Layer w0.254: v1(90.68,51) 92.96,51 92.96,49.07 91.69,47.8 73.41,47.8 72.52,46.91 72.52,27.36 71.75,26.59 64.02,26.59 62.49,28.12 ; R11.1 62.49,28.12 ; 62.49,28.12 63.25,28.12 63.68,28.55 C17.1
  内层2 w0.254: v1(30.1,76.63) 31.75,74.98 61.98,74.98 85.95,51 v1(90.68,51)
  Bottom Layer w0.254: v1(30.1,76.63) H2.11
KEY5: length 145.7
  Top Layer w0.254: v1(67.44,76.63) 67.44,65.35 81.79,51 SW12.1 84.2,49.2 83.16,48.16 73.26,48.16 72.16,47.06 72.16,38.3 72.14,38.28 72.14,27.48 71.61,26.95 66.06,26.95 65.71,27.31 R12.1 65.79,28.12 67.06,28.12 68.22,29.28 C18.1
  内层2 w0.254: v1(67.44,76.63) 67.44,82.86 65.02,85.27 15.62,85.27 14.86,84.51 H2.5
LED0: length 5.5
  Top Layer w0.254: H2.18 47.88,87.19 48.13,87.44
LED1: length 5.4
  Top Layer w0.254: H2.17 45.34,87.43 LED5.2
MISO: length 85.9
  Bottom Layer w0.254: H1.11 30.1,62.92 30.61,62.41 59.82,62.41 63.7,66.3 63.7,96.99 62.5,98.2 62.13,98.2 62.1,98.22 51.82,98.22 49.4,95.81
MOSI: length 59.8
  内层2 w0.254: v1(57.53,68.5) 34.3,68.5 H1.12
  Bottom Layer w0.254: 51.94,93.27 54.23,90.98 59.94,90.98 59.94,90.98 61.19,89.73 61.19,70.9 58.8,68.5 v1(57.53,68.5)
PA1: length 40.9
  Inner1 w0.254: H1.6 17.4,62.15 14.73,59.48 SW1.5
PA2: length 57.5
  Inner1 w0.254: H1.7 19.94,64.19 15.09,59.34 15.09,30.94 15.88,30.15 19.56,30.15 25.15,24.56 25.15,20.04 SW1.2
PA3: length 91.8
  Inner1 w0.254: H1.8 22.48,63.42 23.22,62.69 42.52,62.69 81.15,24.05 86.51,24.05 SW7.2
PA4: length 78.7
  Top Layer w0.254: SW7.5 v1(83.47,29.73)
  Inner1 w0.254: v1(83.47,29.73) 83.47,30.37 50.8,63.04 25.65,63.04 25.02,63.68 H1.9
PB12: length 137
  Top Layer w0.254: v1(0.63,76.51) 0.63,42.35 4.85,38.13 4.85,14.64 5.5,13.99 5.5,10.81 6.71,9.6 16.68,9.6 SW1.d
  Inner1 w0.254: v1(0.63,76.51) 2.54,78.41 v1(20.95,78.41)
  内层2 w0.254: H2.20 52.96,80.7 50.67,78.41 v1(20.95,78.41)
PB13: length 130.4
  Top Layer w0.254: v1(86.99,5.64) 86.99,8.03 SW7.d
  Inner1 w0.254: v1(86.99,5.64) 87.76,4.88 96.14,4.88 98.55,7.29 98.55,42.6 97.71,43.44 73.32,43.44 61.01,55.74 61.01,71.74 57.66,75.09 57.66,82.86 56.77,83.74 52.08,83.74 H2.19
SCL: length 71
  Top Layer w0.254: v1(27.18,77.27) 74.42,77.27 78.87,81.71 OLED1.3
  Bottom Layer w0.254: v1(27.18,77.27) 24.76,77.27 H2.7
SDA: length 76.3
  Top Layer w0.254: OLED1.4 81.41,79.43 80.64,78.66 v1(79.5,78.66) ; 17.41,82.09 20.32,79.17 73.53,79.17 v1(74.04,78.66)
  Inner1 w0.254: v1(79.5,78.66) v1(74.04,78.66)
VUSB: length 88.4
  Top Layer w0.254: 54.23,0.81 54.48,1.07 U1.4 ; 54.23,0.81 58.11,0.81 ; 54.23,0.81 53.85,0.43 47.75,0.43 47.37,0.81 ; 58.11,0.81 58.49,0.43 68.33,0.43 68.83,0.94 68.83,3.48 ; 58.11,0.81 59.05,0.81 v1(59.82,1.58) ; 47.37,0.81 46.86,1.32 46.86,10.34 47.37,10.85 50.17,10.85 50.67,10.34 U1.8 ; 47.37,0.81 37.21,0.81 36.7,1.32 36.7,8.18 37.21,8.69 40.77,8.69 41.15,8.31 41.15,6.39 USB1.1 ; U12.2 65.69,6.4 68.45,6.4 68.83,6.02 68.83,3.48 ; 68.83,3.48 68.41,3.9 U13.2 ; v1(59.44,9.83) 57.72,9.83
  Inner1 w0.254: v1(59.44,9.83) 59.82,9.45 v1(59.82,1.58)
$1N9186: length 14
  Top Layer w0.254: v1(62.23,1.45) U10.1 ; v1(51.94,1.07) U1.2
  Inner1 w0.254: v1(62.23,1.45) 61.21,0.43 52.58,0.43 v1(51.94,1.07)
$1N9797: length 9.6
  Top Layer w0.254: v1(55.75,8.31) 57.53,8.31 57.91,7.93 57.91,7.31 LED1.1 ; U1.7 51.94,9.07 52.2,9.32 v1(52.58,9.32)
  Inner1 w0.254: v1(55.75,8.31) 53.59,8.31 v1(52.58,9.32)
$1N9800: length 10.6
  Top Layer w0.254: U1.6 53.21,9.2 53.34,9.32 v1(53.72,9.32) ; v1(57.28,6.66) 57.28,5.53 58.86,3.95
  Inner1 w0.254: v1(57.28,6.66) 57.28,8.05 56.01,9.32 v1(53.72,9.32)
$1N9803: length 3.7
  Top Layer w0.254: LED1.2 60.47,6.36 U12.1
$1N9806: length 3.7
  Top Layer w0.254: U13.1 60.53,3.9 60.46,3.83
$1N10862: length 3.2
  Top Layer w0.254: LED3.2 29.34,49.45 U14.1
$1N14342: length 5.3
  Top Layer w0.254: U4.4 33.59,45.83 33.91,45.52 U16.1
$1N14522: length 28.7
  Top Layer w0.254: 34.35,55.23 33.53,56.06 33.53,58.09 34.67,59.23 41.53,59.23 41.78,58.98 41.78,52.12 41.53,51.87 R7.2 ; 34.35,55.23 33.53,54.41 33.53,52.07 U4.3 ; 34.35,55.23 34.8,55.68 R13.1
$1N23594: length 15.6
  Top Layer w0.254: 54.48,9.45 U1.5 ; 54.48,9.45 v1(53.85,10.08) ; 54.48,9.45 54.48,10.91 56.32,12.75 ; LED6.2 44.95,10.85 v1(46.48,10.85)
  Inner1 w0.254: v1(46.48,10.85) 47.24,10.08 v1(53.85,10.08)
$1N23595: length 6.3
  Top Layer w0.254: LED6.1 40.73,13.45 D1.2
$1N23688: length 43.3
  Top Layer w0.254: v1(40.89,55.68) R13.2 38.09,54.15 36.2,54.15 35.49,53.45 U4.1 ; U6.1 47.04,45.77 49.02,45.77 50.04,46.79 50.04,54.66 49.02,55.68 v1(42.93,55.68) 42.14,56.46 42.14,59.13 41.68,59.59 39.01,59.59 37.72,60.88 D3.2
  Inner1 w0.254: v1(40.89,55.68) v1(42.93,55.68)

## Text on the board
Top Layer: By FlandreDT | 南梁·北朝
